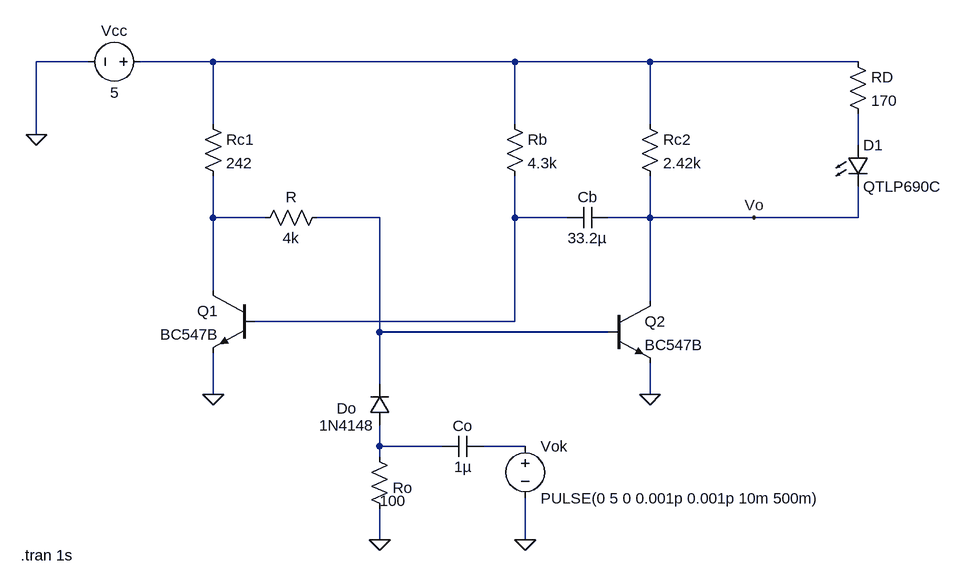
[diagram p0: schematic LT-Spice sema.asc]
LT-Spice sema.asc, the LTspice schematic file:
Version 4
SHEET 1 1216 680
WIRE -192 -224 -272 -224
WIRE 0 -224 -112 -224
WIRE 464 -224 0 -224
WIRE 672 -224 464 -224
WIRE 992 -224 672 -224
WIRE 0 -128 0 -224
WIRE 464 -128 464 -224
WIRE 672 -128 672 -224
WIRE -272 -112 -272 -224
WIRE 992 -96 992 -144
WIRE 0 16 0 -48
WIRE 80 16 0 16
WIRE 256 16 160 16
WIRE 464 16 464 -48
WIRE 544 16 464 16
WIRE 672 16 672 -48
WIRE 672 16 608 16
WIRE 832 16 672 16
WIRE 992 16 992 -32
WIRE 992 16 832 16
WIRE 0 128 0 16
WIRE 672 144 672 16
WIRE 464 176 464 16
WIRE 464 176 64 176
WIRE 256 192 256 16
WIRE 608 192 256 192
WIRE 256 272 256 192
WIRE 0 288 0 224
WIRE 672 288 672 240
WIRE 256 368 256 336
WIRE 352 368 256 368
WIRE 480 368 416 368
WIRE 256 384 256 368
WIRE 256 512 256 464
WIRE 480 512 480 448
FLAG 0 288 0
FLAG 672 288 0
FLAG -272 -112 0
FLAG 832 16 Vo
FLAG 256 512 0
FLAG 480 512 0
SYMBOL npn 64 128 M0
SYMATTR InstName Q1
SYMATTR Value BC547B
SYMBOL npn 608 144 R0
SYMATTR InstName Q2
SYMATTR Value BC547B
SYMBOL res -16 -144 R0
SYMATTR InstName Rc1
SYMATTR Value 242
SYMBOL res 656 -144 R0
SYMATTR InstName Rc2
SYMATTR Value 2.42k
SYMBOL res 448 -144 R0
SYMATTR InstName Rb
SYMATTR Value 4.3k
SYMBOL cap 608 0 R90
WINDOW 0 0 32 VBottom 2
WINDOW 3 32 32 VTop 2
SYMATTR InstName Cb
SYMATTR Value 33.2µ
SYMBOL voltage -96 -224 R90
WINDOW 0 -32 56 VBottom 2
WINDOW 3 32 56 VTop 2
WINDOW 123 0 0 Left 0
WINDOW 39 0 0 Left 0
SYMATTR InstName Vcc
SYMATTR Value 5
SYMBOL res 176 0 R90
WINDOW 0 0 56 VBottom 2
WINDOW 3 32 56 VTop 2
SYMATTR InstName R
SYMATTR Value 4k
SYMBOL diode 272 336 R180
WINDOW 0 51 26 Left 2
WINDOW 3 24 0 Left 2
SYMATTR InstName Do
SYMATTR Value 1N4148
SYMBOL res 240 368 R0
WINDOW 0 36 64 Left 2
WINDOW 3 16 84 Left 2
SYMATTR InstName Ro
SYMATTR Value 100
SYMBOL cap 416 352 R90
WINDOW 0 0 32 VBottom 2
WINDOW 3 32 32 VTop 2
SYMATTR InstName Co
SYMATTR Value 1µ
SYMBOL voltage 480 352 R0
WINDOW 123 0 0 Left 0
WINDOW 39 0 0 Left 0
SYMATTR InstName Vok
SYMATTR Value PULSE(0 5 0 0.001p 0.001p 10m 500m)
SYMBOL res 976 -240 R0
SYMATTR InstName RD
SYMATTR Value 170
SYMBOL LED 976 -96 R0
SYMATTR InstName D1
SYMATTR Value QTLP690C
TEXT -296 536 Left 2 !.tran 1s

The netlist it stands for:
* LT-Spice sema.asc
Q1 N003 N005 0 0 BC547B
Q2 Vo N004 0 0 BC547B
Rc1 N001 N003 242
Rc2 N001 Vo 2.42k
Rb N001 N005 4.3k
Cb Vo N005 33.2µ
Vcc N001 0 5
R N004 N003 4k
Do N006 N004 1N4148
Ro N006 0 100
Co N007 N006 1µ
Vok N007 0 PULSE(0 5 0 0.001p 0.001p 10m 500m)
RD N001 N002 170
D1 N002 Vo QTLP690C
.model D D
.lib standard.dio
.model NPN NPN
.model PNP PNP
.lib standard.bjt
.tran 1s
.backanno
.end